# EAGLE schematic DEC4 (EAGLE 9.4.2)
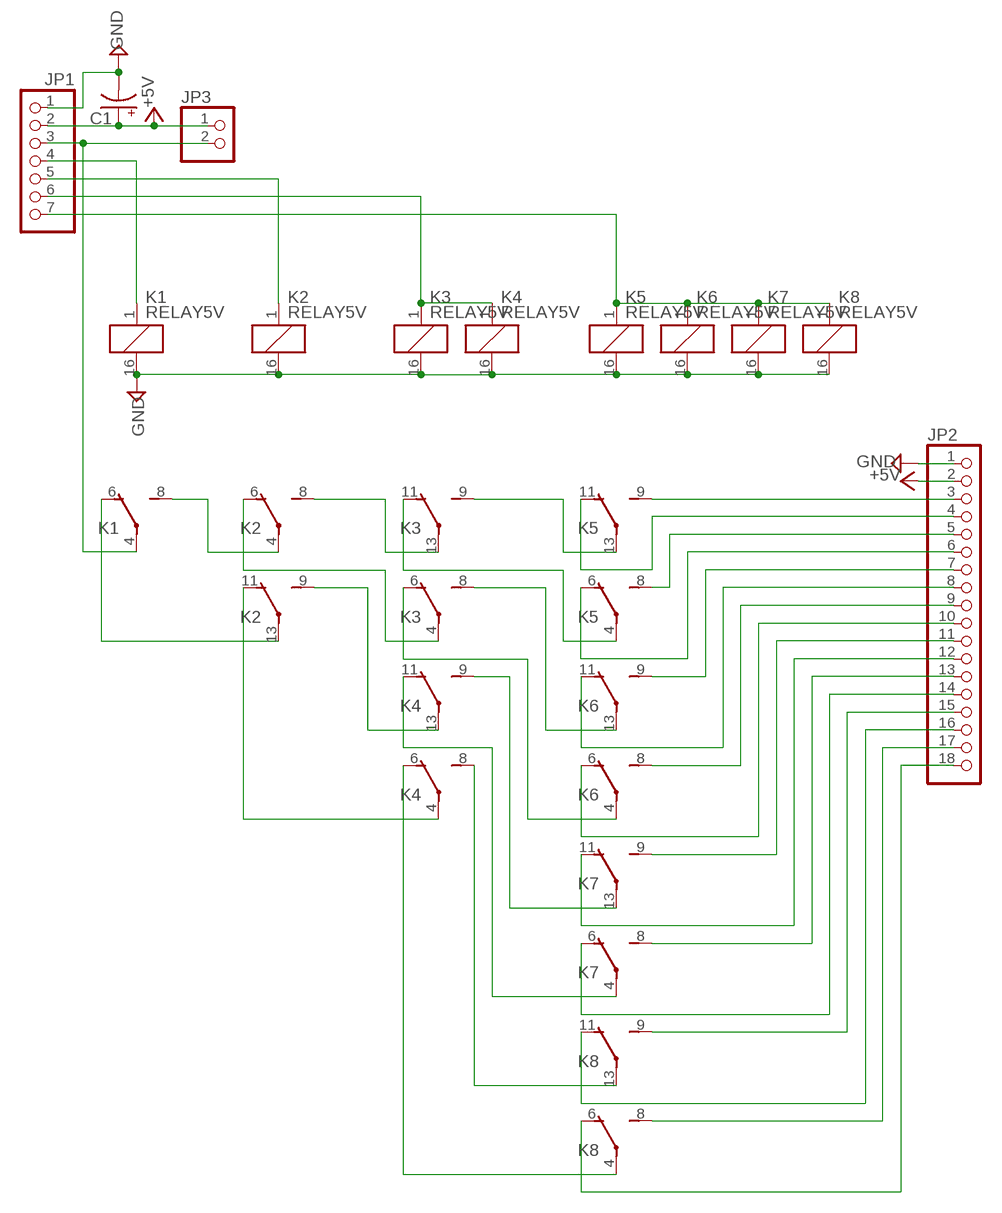
[diagram p0: schematic, sheet 1]

## Parts
C1  CC-5-8.5  [E5-8,5]
JP1  PINHD-1X7  [1X07]
JP2  PINHD-1X18  [1X18]
JP3  PINHD-1X2  [1X02]
K1  RELAY5V  [DS-BT]
K2  RELAY5V  [DS-BT]
K3  RELAY5V  [DS-BT]
K4  RELAY5V  [DS-BT]
K5  RELAY5V  [DS-BT]
K6  RELAY5V  [DS-BT]
K7  RELAY5V  [DS-BT]
K8  RELAY5V  [DS-BT]

## Nets
+5V: C1.+ JP1.2 JP2.2 JP3.1
GND: C1.- JP1.1 JP2.1 K1.16(1:-) K2.16(1:-) K3.16(1:-) K4.16(1:-) K5.16(1:-) K6.16(1:-) K7.16(1:-) K8.16(1:-)
N$1: K1.8(2:S) K2.4(2:P)
N$2: K1.6(2:O) K2.13(3:P)
N$3: K2.8(2:S) K3.13(3:P)
N$4: K2.6(2:O) K3.4(2:P)
N$5: K2.9(3:S) K4.13(3:P)
N$6: K2.11(3:O) K4.4(2:P)
N$7: K3.9(3:S) K5.13(3:P)
N$8: K3.11(3:O) K5.4(2:P)
N$9: K3.8(2:S) K6.13(3:P)
N$10: K3.6(2:O) K6.4(2:P)
N$11: K4.9(3:S) K7.13(3:P)
N$12: K4.11(3:O) K7.4(2:P)
N$13: K4.8(2:S) K8.13(3:P)
N$14: K4.6(2:O) K8.4(2:P)
N$15: JP2.3 K5.9(3:S)
N$16: JP1.6 K3.1(1:+) K4.1(1:+)
N$17: JP1.7 K5.1(1:+) K6.1(1:+) K7.1(1:+) K8.1(1:+)
N$18: JP2.4 K5.11(3:O)
N$19: JP1.4 K1.1(1:+)
N$20: JP1.5 K2.1(1:+)
N$21: JP2.5 K5.8(2:S)
N$22: JP2.6 K5.6(2:O)
N$23: JP2.7 K6.9(3:S)
N$24: JP2.8 K6.11(3:O)
N$25: JP2.9 K6.8(2:S)
N$26: JP2.10 K6.6(2:O)
N$27: JP2.11 K7.9(3:S)
N$28: JP2.12 K7.11(3:O)
N$29: JP2.13 K7.8(2:S)
N$30: JP2.14 K7.6(2:O)
N$31: JP2.15 K8.9(3:S)
N$32: JP2.16 K8.11(3:O)
N$33: JP2.17 K8.8(2:S)
N$34: JP2.18 K8.6(2:O)
N$35: JP1.3 JP3.2 K1.4(2:P)
Unconnected: K1.9(3:S) K1.11(3:O) K1.13(3:P)

## Library data of the parts
C1 = Passive_Robotech:CC
JP1 = pinhead:PINHD-1X7: PIN HEADER
JP2 = pinhead:PINHD-1X18: PIN HEADER
JP3 = pinhead:PINHD-1X2: PIN HEADER
K1-K8 = My:RELAY: DS-BT RELAYS 4,000 V BREAKDOWN VOLTAGE NAiS Source: http://www.mew-europe.com/.. en_ds_61005_0010.pdf

## Net classes
0 default: width 0.406 mm